# Altium schematic sheet Sheet7.SchDoc
size A4; SheetNumber: 2; SheetTotal: 2
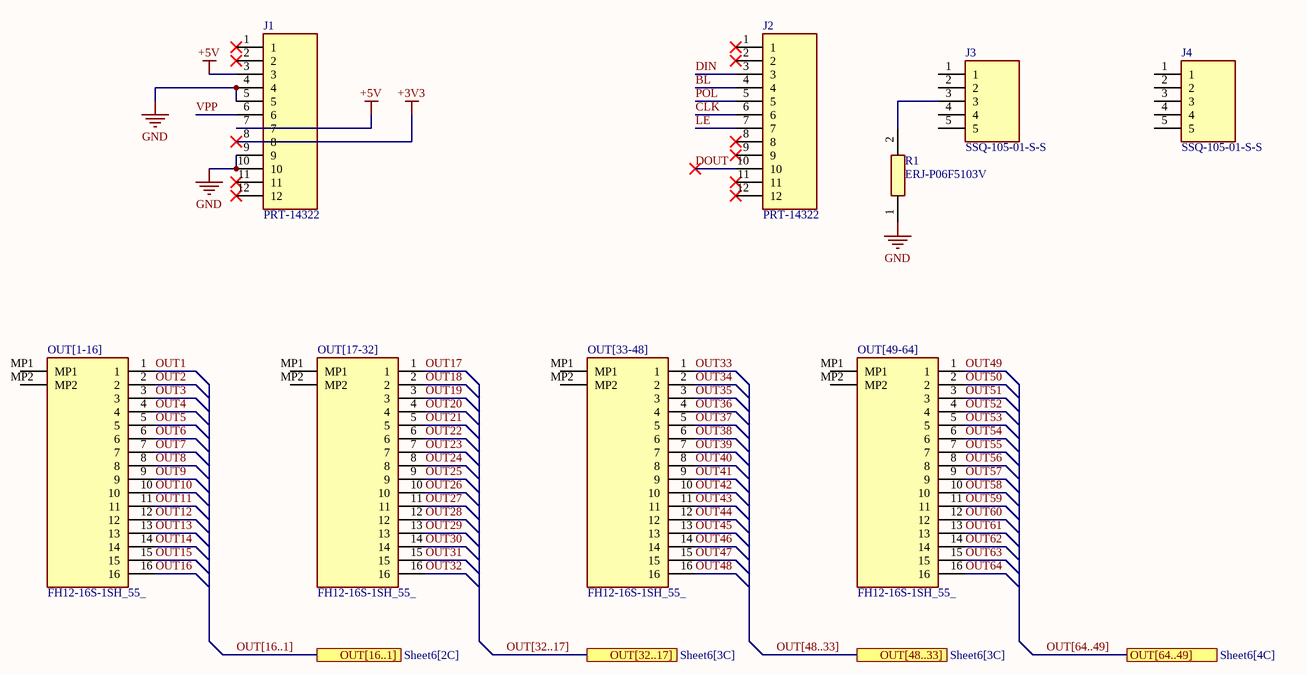
[diagram p0: Sheet7.SchDoc]

## Parts
J1  PRT-14322  [RHDR12W87P0X254_1X12_3103X250X865P]
J2  PRT-14322  [RHDR12W87P0X254_1X12_3103X250X865P]
J3  SSQ-105-01-S-S  [RHDR5W64P254_1X5_1321X241X851P]
J4  SSQ-105-01-S-S  [RHDR5W64P254_1X5_1321X241X851P]
OUT[1-16]  FH12-16S-1SH_55_  [FH1216S1SH55]
OUT[17-32]  FH12-16S-1SH_55_  [FH1216S1SH55]
OUT[33-48]  FH12-16S-1SH_55_  [FH1216S1SH55]
OUT[49-64]  FH12-16S-1SH_55_  [FH1216S1SH55]
R1  ERJ-P06F5103V  [ERJP06D1000V]

## Ports
OUT[16..1] (see Sheet6[2C]), OUT[32..17] (see Sheet6[3C]), OUT[48..33] (see Sheet6[3C]), OUT[64..49] (see Sheet6[4C])

## Nets
+3V3: J1.8
+5V: J1.3 J1.7
GND: J1.4 J1.5 J1.9 J1.10 R1.1
BL: J2.4
CLK: J2.6
DIN: J2.3
DOUT: J2.10
LE: J2.7
OUT1: OUT[1-16].1
OUT2: OUT[1-16].2
OUT3: OUT[1-16].3
OUT4: OUT[1-16].4
OUT5: OUT[1-16].5
OUT6: OUT[1-16].6
OUT7: OUT[1-16].7
OUT8: OUT[1-16].8
OUT9: OUT[1-16].9
OUT10: OUT[1-16].10
OUT11: OUT[1-16].11
OUT12: OUT[1-16].12
OUT13: OUT[1-16].13
OUT14: OUT[1-16].14
OUT15: OUT[1-16].15
OUT16: OUT[1-16].16
OUT17: OUT[17-32].1
OUT18: OUT[17-32].2
OUT19: OUT[17-32].3
OUT20: OUT[17-32].4
OUT21: OUT[17-32].5
OUT22: OUT[17-32].6
OUT23: OUT[17-32].7
OUT24: OUT[17-32].8
OUT25: OUT[17-32].9
OUT26: OUT[17-32].10
OUT27: OUT[17-32].11
OUT28: OUT[17-32].12
OUT29: OUT[17-32].13
OUT30: OUT[17-32].14
OUT31: OUT[17-32].15
OUT32: OUT[17-32].16
OUT33: OUT[33-48].1
OUT34: OUT[33-48].2
OUT35: OUT[33-48].3
OUT36: OUT[33-48].4
OUT37: OUT[33-48].5
OUT38: OUT[33-48].6
OUT39: OUT[33-48].7
OUT40: OUT[33-48].8
OUT41: OUT[33-48].9
OUT42: OUT[33-48].10
OUT43: OUT[33-48].11
OUT44: OUT[33-48].12
OUT45: OUT[33-48].13
OUT46: OUT[33-48].14
OUT47: OUT[33-48].15
OUT48: OUT[33-48].16
OUT49: OUT[49-64].1
OUT50: OUT[49-64].2
OUT51: OUT[49-64].3
OUT52: OUT[49-64].4
OUT53: OUT[49-64].5
OUT54: OUT[49-64].6
OUT55: OUT[49-64].7
OUT56: OUT[49-64].8
OUT57: OUT[49-64].9
OUT58: OUT[49-64].10
OUT59: OUT[49-64].11
OUT60: OUT[49-64].12
OUT61: OUT[49-64].13
OUT62: OUT[49-64].14
OUT63: OUT[49-64].15
OUT64: OUT[49-64].16
POL: J2.5
VPP: J1.6
NetJ3_3: J3.3 R1.2

Not connected (* = marked no-connect by the designer): J1 1* 2* 11* 12*; J2 1* 2* 8* 9* 11* 12*; J3 1 2 4 5; J4 1 2 3 4 5; OUT[1-16] MP1 MP2; OUT[17-32] MP1 MP2; OUT[33-48] MP1 MP2; OUT[49-64] MP1 MP2

## Buses and harness runs
bus OUT[16..1] = port OUT[16..1]
bus OUT[32..17] = port OUT[32..17]
bus OUT[48..33] = port OUT[48..33]
bus OUT[64..49] = port OUT[64..49]

## Library data of the parts
J1 J2 = PRT-14322: SparkFun Accessories Photon Stackable Header- 12 Pin; Geometry.Height: 8.65mm; Mouser Part Number: 474-PRT-14322; Mouser Price/Stock: https://www.mouser.co.uk/ProductDetail/SparkFun/PRT-14322?qs=YCa%2FAAYMW006l9RrtPHkxQ%3D%3D; Manufacturer_Name: SparkFun; Manufacturer_Part_Number: PRT-14322; Datasheet Link: https://cdn.sparkfun.com/datasheets/Prototyping/SP-140520-XX-001.pdf
J3 J4 = SSQ-105-01-S-S: 5 Position, .100&quot; Tiger Buy&trade; Socket Strip, Square Tail, Single Row; Manufacturer_Name: SAMTEC; Geometry.Height: 8.51mm; Mouser Part Number: 200-SSQ10501SS; Mouser Price/Stock: https://www.mouser.co.uk/ProductDetail/Samtec/SSQ-105-01-S-S?qs=rU5fayqh%252BE15SmaD0WxGBw%3D%3D; Manufacturer_Part_Number: SSQ-105-01-S-S; Datasheet Link: http://suddendocs.samtec.com/prints/ssq-1xx-xx-xxx-x-xx-xxx-xx-x-mkt.pdf
OUT[1-16] OUT[17-32] OUT[33-48] OUT[49-64] = FH12-16S-1SH_55_: Connector; Manufacturer_Name: Hirose; Manufacturer_Part_Number: FH12-16S-1SH(55); Datasheet Link: https://datasheet.datasheetarchive.com/originals/distributors/SFDatasheet-1/sf-00023459.pdf; Height: 2.2mm; Mouser Part Number: 798-FH12-16S-1SH55; Mouser Price/Stock: https://www.mouser.co.uk/ProductDetail/Hirose-Connector/FH12-16S-1SH55?qs=Ux3WWAnHpjBc3pYMMfcXYg%3D%3D; Arrow Part Number: FH12-16S-1SH(55); Arrow Price/Stock: https://www.arrow.com/en/products/fh12-16s-1sh-55/hirose-electric
R1 = ERJ-P06F5103V: Resistor; Manufacturer_Name: Panasonic; Datasheet Link: http://industrial.panasonic.com/cdbs/www-data/pdf/RDA0000/AOA0000C102.pdf; Height: 0.7mm; Manufacturer_Part_Number: ERJ-P06F5103V; Mouser Part Number: 667-ERJ-P06F5103V; Mouser Price/Stock: https://www.mouser.co.uk/ProductDetail/Panasonic/ERJ-P06F5103V?qs=iIVTEDlrHA2ZP3yozH4uHg%3D%3D